# EAGLE design camera (EAGLE 6.1)
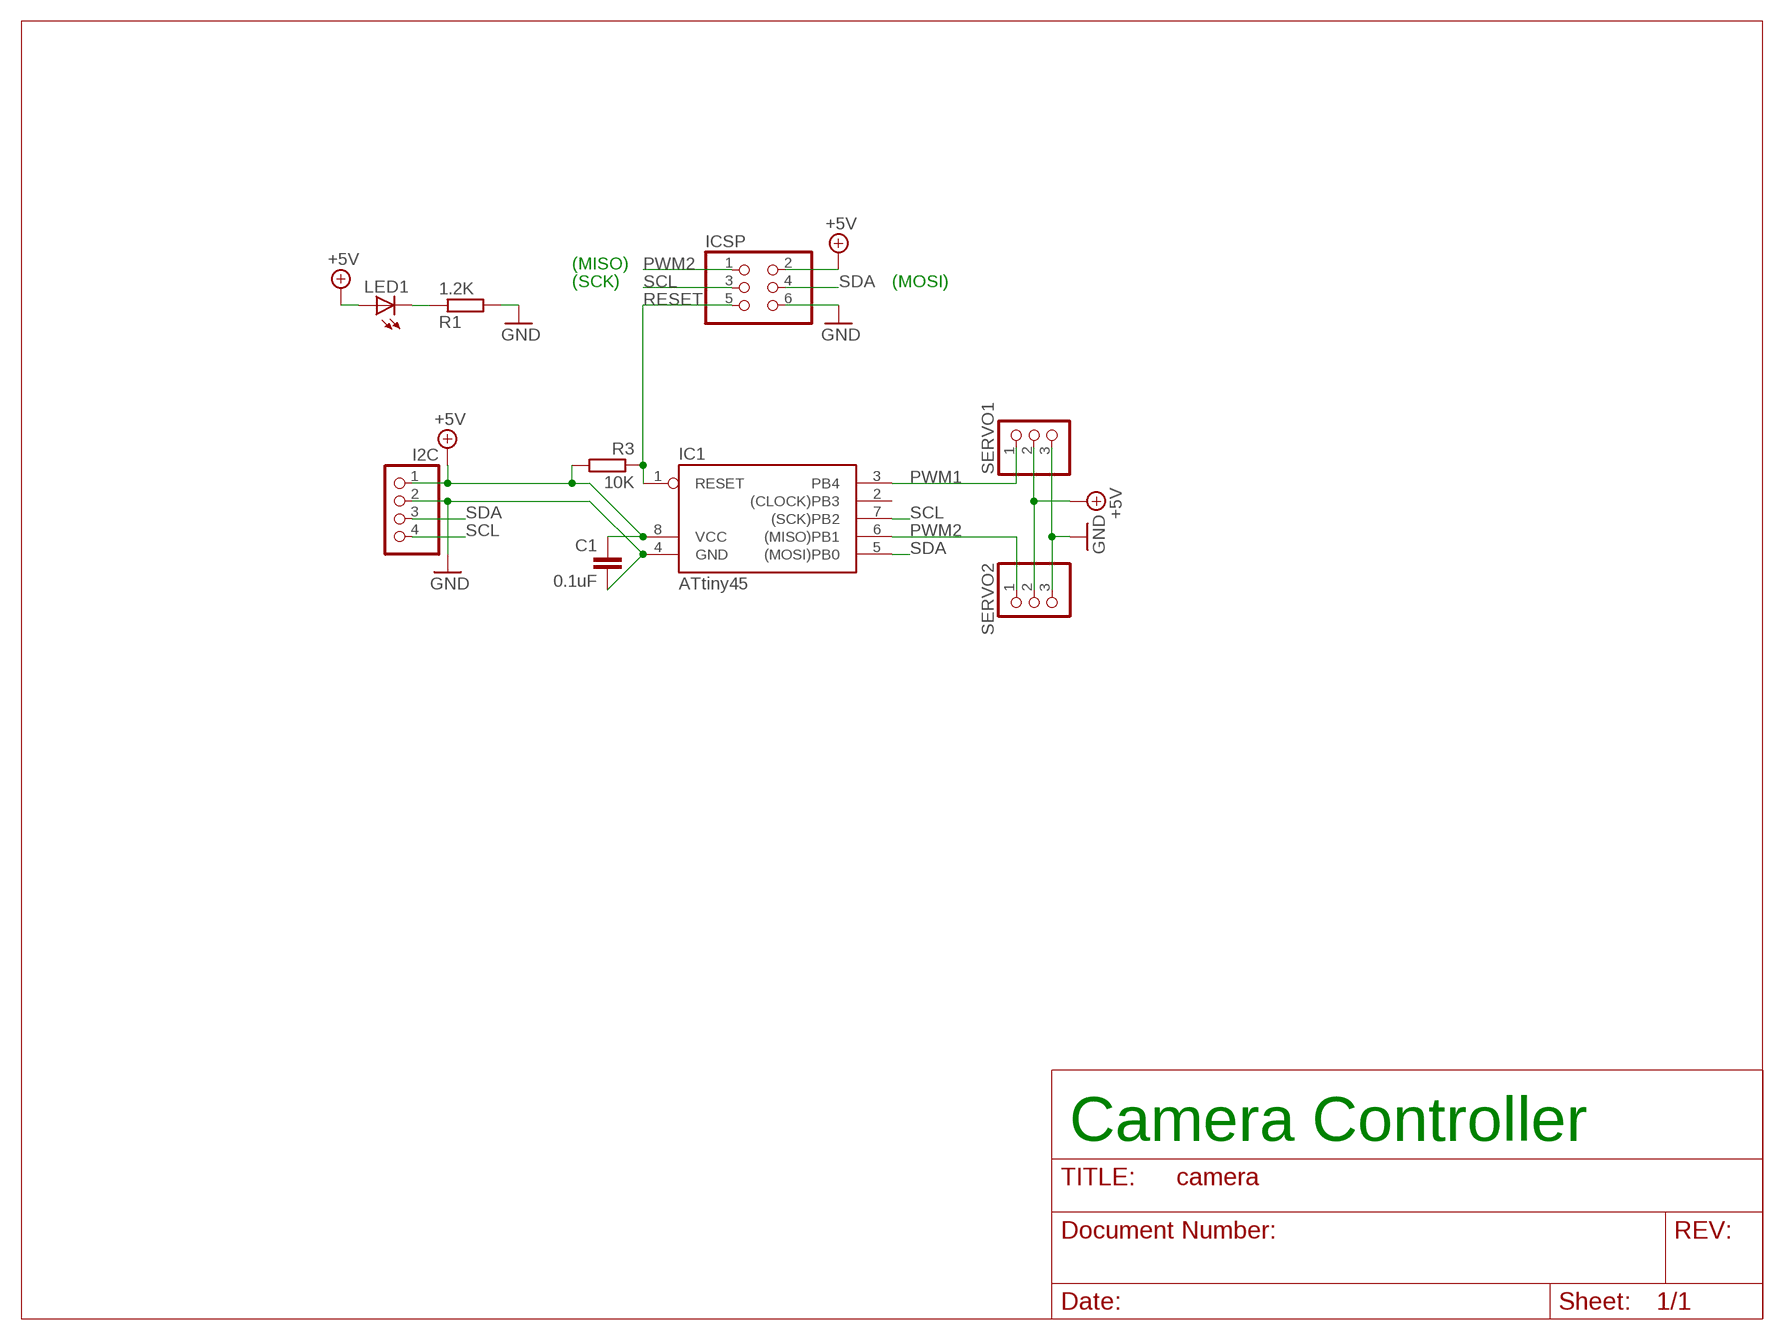
[diagram p0: schematic, sheet 1]

## Parts
C1  0.1uF  C-EU025-024X044  [C025-024X044]
I2C  PINHD-1X4  [1X04]
IC1  ATtiny45  TINY22P  [DIL08]
ICSP  PINHD-2X3  [2X03]
LED1  LED5MM  [LED5MM]
R1  1.2K  R-EU_0207/2V  [0207/2V]
R3  10K  R-EU_0207/2V  [0207/2V]
SERVO1  PINHD-1X3  [1X03]
SERVO2  PINHD-1X3  [1X03]

## Nets
+5V: C1.1 I2C.1 IC1.8(VCC) ICSP.2 LED1.A R3.2 SERVO1.2 SERVO2.2
GND: C1.2 I2C.2 IC1.4(GND) ICSP.6 R1.2 SERVO1.3 SERVO2.3
N$1: LED1.K(C) R1.1
PWM1: IC1.3(PB4) SERVO1.1
PWM2: IC1.6((MISO)PB1) ICSP.1 SERVO2.1
RESET: IC1.1(RESET) ICSP.5 R3.1
SCL: I2C.4 IC1.7((SCK)PB2) ICSP.3
SDA: I2C.3 IC1.5((MOSI)PB0) ICSP.4
Unconnected: IC1.2((CLOCK)PB3)

## Notes on the sheet
- (MISO)
- (SCK) | (MOSI)
- Camera Controller

## Library data of the parts
C1 = rcl:C-EU: CAPACITOR, European symbol
I2C = pinhead:PINHD-1X4: PIN HEADER
IC1 = atmel:TINY22: MICROCONTROLLER 1K ROM 128 bytes RAM 128 bytes EEPROM; OC_FARNELL: unknown; OC_NEWARK: unknown
ICSP = pinhead:PINHD-2X3: PIN HEADER
LED1 = led:LED: LED OSRAM: - CHIPLED LG R971, LG N971, LY N971, LG Q971, LY Q971, LO R971, LY R971 LH N974, LH R974 LS Q976, LO Q976, LY Q976 LO Q996 - Hyper CHIPLED LW Q18S LB Q993, LB Q99A, LB R99A - SideLED LS A670, LO A670, LY A670, LG A670, LP A670 LB A673, LV A673, LT A673, LW A673 LH A674 LY A675 LS A676, LA A676, LO A676, LY A676, LW A676 LS A679, LY A679, LG A679 - Hyper Micro SIDELED® LS Y876, LA Y876, LO Y876, LY Y876 LT Y87S - SmartLED LW L88C, LW L88S LB L89C, LB L89S, LG L890 LS L89K, LO L89K, LY L89K LS L896, LA L896, LO L896, LY L896 - TOPLED LS T670, LO T670, LY T670, LG T670, LP T670 LSG T670, LSP T670, LSY T670, LOP T670, LYG T670 LG T671, LOG T671, LSG T671 LB T673, LV T673, LT T673, LW T673 LH T674 LS T676, LA T676, LO T676, LY T676, LB T676, LH T676, LSB T676, LW T676 LB T67C, LV T67C, LT T67C, LS T67K, LO T67K, LY T67K, LW E67C LS E67B, LA E67B, LO E67B, LY E67B, LB E67C, LV E67C, LT E67C LW T67C LS T679, LY T679, LG T679 LS T770, LO T770, LY T770, LG T770, LP T770 LB T773, LV T773, LT T773, LW T773 LH T774 LS E675, LA E675, LY E675, LS T675 LS T776, LA T776, LO T776, LY T776, LB T776 LHGB T686 LT T68C, LB T68C - Hyper Mini TOPLED® LB M676 - Mini TOPLED Santana® LG M470 LS M47K, LO M47K, LY M47K Source: http://www.osram.convergy.de LUXEON: - LUMILED® LXK2-PW12-R00, LXK2-PW12-S00, LXK2-PW14-U00, LXK2-PW14-V00 LXK2-PM12-R00, LXK2-PM12-S00, LXK2-PM14-U00 LXK2-PE12-Q00, LXK2-PE12-R00, LXK2-PE12-S00, LXK2-PE14-T00, LXK2-PE14-U00 LXK2-PB12-K00, LXK2-PB12-L00, LXK2-PB12-M00, LXK2-PB14-N00, LXK2-PB14-P00, LXK2-PB14-Q00 LXK2-PR12-L00, LXK2-PR12-M00, LXK2-PR14-Q00, LXK2-PR14-R00 LXK2-PD12-Q00, LXK2-PD12-R00, LXK2-PD12-S00 LXK2-PH12-R00, LXK2-PH12-S00 LXK2-PL12-P00, LXK2-PL12-Q00, LXK2-PL12-R00 Source: www.luxeon.com KINGBRIGHT: KA-3528ASYC Source: www.kingbright.com
R1 R3 = rcl:R-EU_: RESISTOR, European symbol
SERVO1 SERVO2 = pinhead:PINHD-1X3: PIN HEADER

## Board
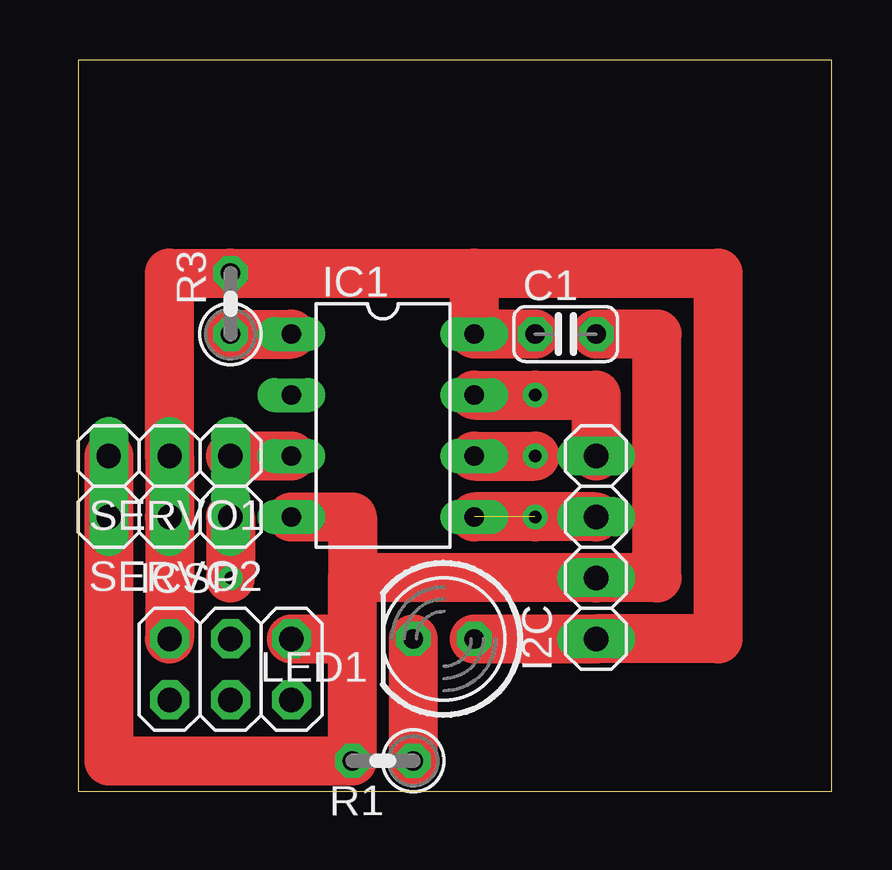
[diagram p1: board, top side]
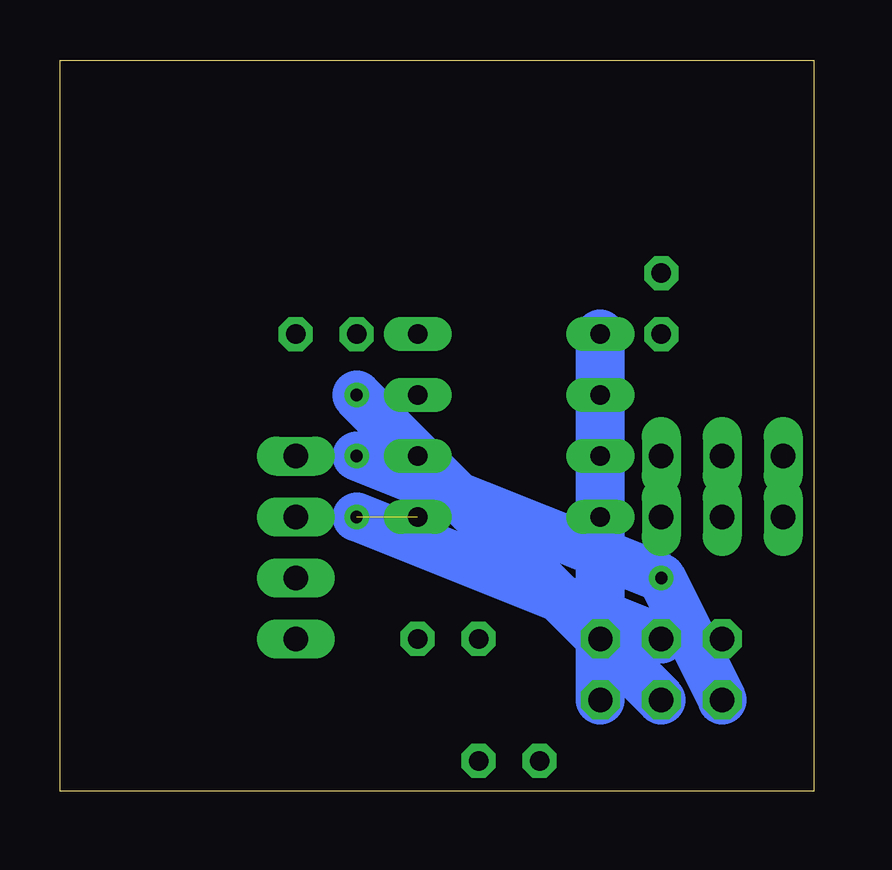
[diagram p2: board, bottom side, seen from below]

Size 31.42 x 30.47 mm. Coordinates in mm from the lower left corner, seen from the top.
Outline: 0,0 31.42,0 31.42,30.47 0,30.47 0,0
Copper layers (1*16): Top 0.035mm / dielectric 1.5mm / Bottom 0.035mm
Design rules: minimum track width 8mil, minimum drill 20mil, track to track 8mil, track to pad 8mil, pad to pad 8mil, via to via 8mil, smd to smd 8mil, copper to edge 10mil, drill to drill 8mil, minimum pad ring 12mil, minimum via ring 10mil, stop-mask expansion 4mil, vias tented up to drill 25mil, thermal gap 10mil

### Footprints (pad centres in the part's own frame; a part is rotated, then mirrored left to right if it is on the bottom)
C025-024X044 = drill 0.813 octagon: 1 -1.27,0; 2 1.27,0
1X04 = drill 1.016 long: 1 -3.81,0; 2 -1.27,0; 3 1.27,0; 4 3.81,0
DIL08 = drill 0.813 long: 1 -3.81,-3.81; 2 -1.27,-3.81; 3 1.27,-3.81; 4 3.81,-3.81; 5 3.81,3.81; 6 1.27,3.81; 7 -1.27,3.81; 8 -3.81,3.81
2X03 = drill 1.016 octagon: 1 -2.54,-1.27; 2 -2.54,1.27; 3 0,-1.27; 4 0,1.27; 5 2.54,-1.27; 6 2.54,1.27
LED5MM = drill 0.813 octagon: A -1.27,0; K 1.27,0
0207/2V = drill 0.813 octagon: 1 -1.27,0; 2 1.27,0
1X03 = drill 1.016 long: 1 -2.54,0; 2 0,0; 3 2.54,0

### Placement (x,y rotation side)
C1  20.32,19.05 0 top
I2C  21.59,10.16 90 top
IC1  12.7,15.24 270 top
ICSP  6.35,5.08 0 top
LED1  15.24,6.35 180 top
R1  12.7,1.27 180 top
R3  6.35,20.32 90 top
SERVO1  3.81,13.97 180 top
SERVO2  3.81,11.43 180 top

### Tracks (layer width: path | path; a pad name or v marks a point on that pad's centre or on a via)
+5V
  Top 2.032: ICSP.2 SERVO2.2 SERVO1.2 3.81,21.59 R3.2 16.51,21.59 | LED1.A I2C.1 26.67,6.35 26.67,21.59 16.51,21.59 | C1.1 IC1.8 16.51,21.59
GND
  Top 2.032: SERVO1.3 SERVO2.3 1.27,1.27 R1.2 11.43,6.35 | 11.43,8.89 I2C.2 24.13,8.89 24.13,19.05 C1.2 | 11.43,6.35 11.43,8.89 | ICSP.6 11.43,6.35 | IC1.4 11.43,11.43 11.43,8.89
N$1
  Top 2.032: R1.1 LED1.K
N$2  (via drill 0.51)
  other vias: 19.05,13.97
N$3  (via drill 0.51)
  other vias: 19.05,16.51
PWM1
  Top 2.032: IC1.3 SERVO1.1
PWM2  (via drill 0.51)
  Top 2.032: IC1.6 v19.05,13.97 | SERVO2.1 v6.35,8.89
  Bottom 2.032: ICSP.1 v6.35,8.89 v19.05,13.97
RESET
  Top 2.032: R3.1 IC1.1
  Bottom 2.032: ICSP.5 IC1.1
SCL  (via drill 0.51)
  Top 2.032: I2C.4 21.59,16.51 v19.05,16.51 IC1.7
  Bottom 2.032: v19.05,16.51 ICSP.3
SDA  (via drill 0.51)  (1 unrouted)
  Top 2.032: I2C.3 v19.05,11.43 IC1.5
  Bottom 2.032: ICSP.4 v19.05,11.43